# EasyEDA schematic SCH_Solární-měřič_2024-04-14.json
TITLE: Sheet_1; REV: 1.0; Date: 2024-04-11; Sheet: 1/1; Drawn By: TomTrom; Company: Your Company
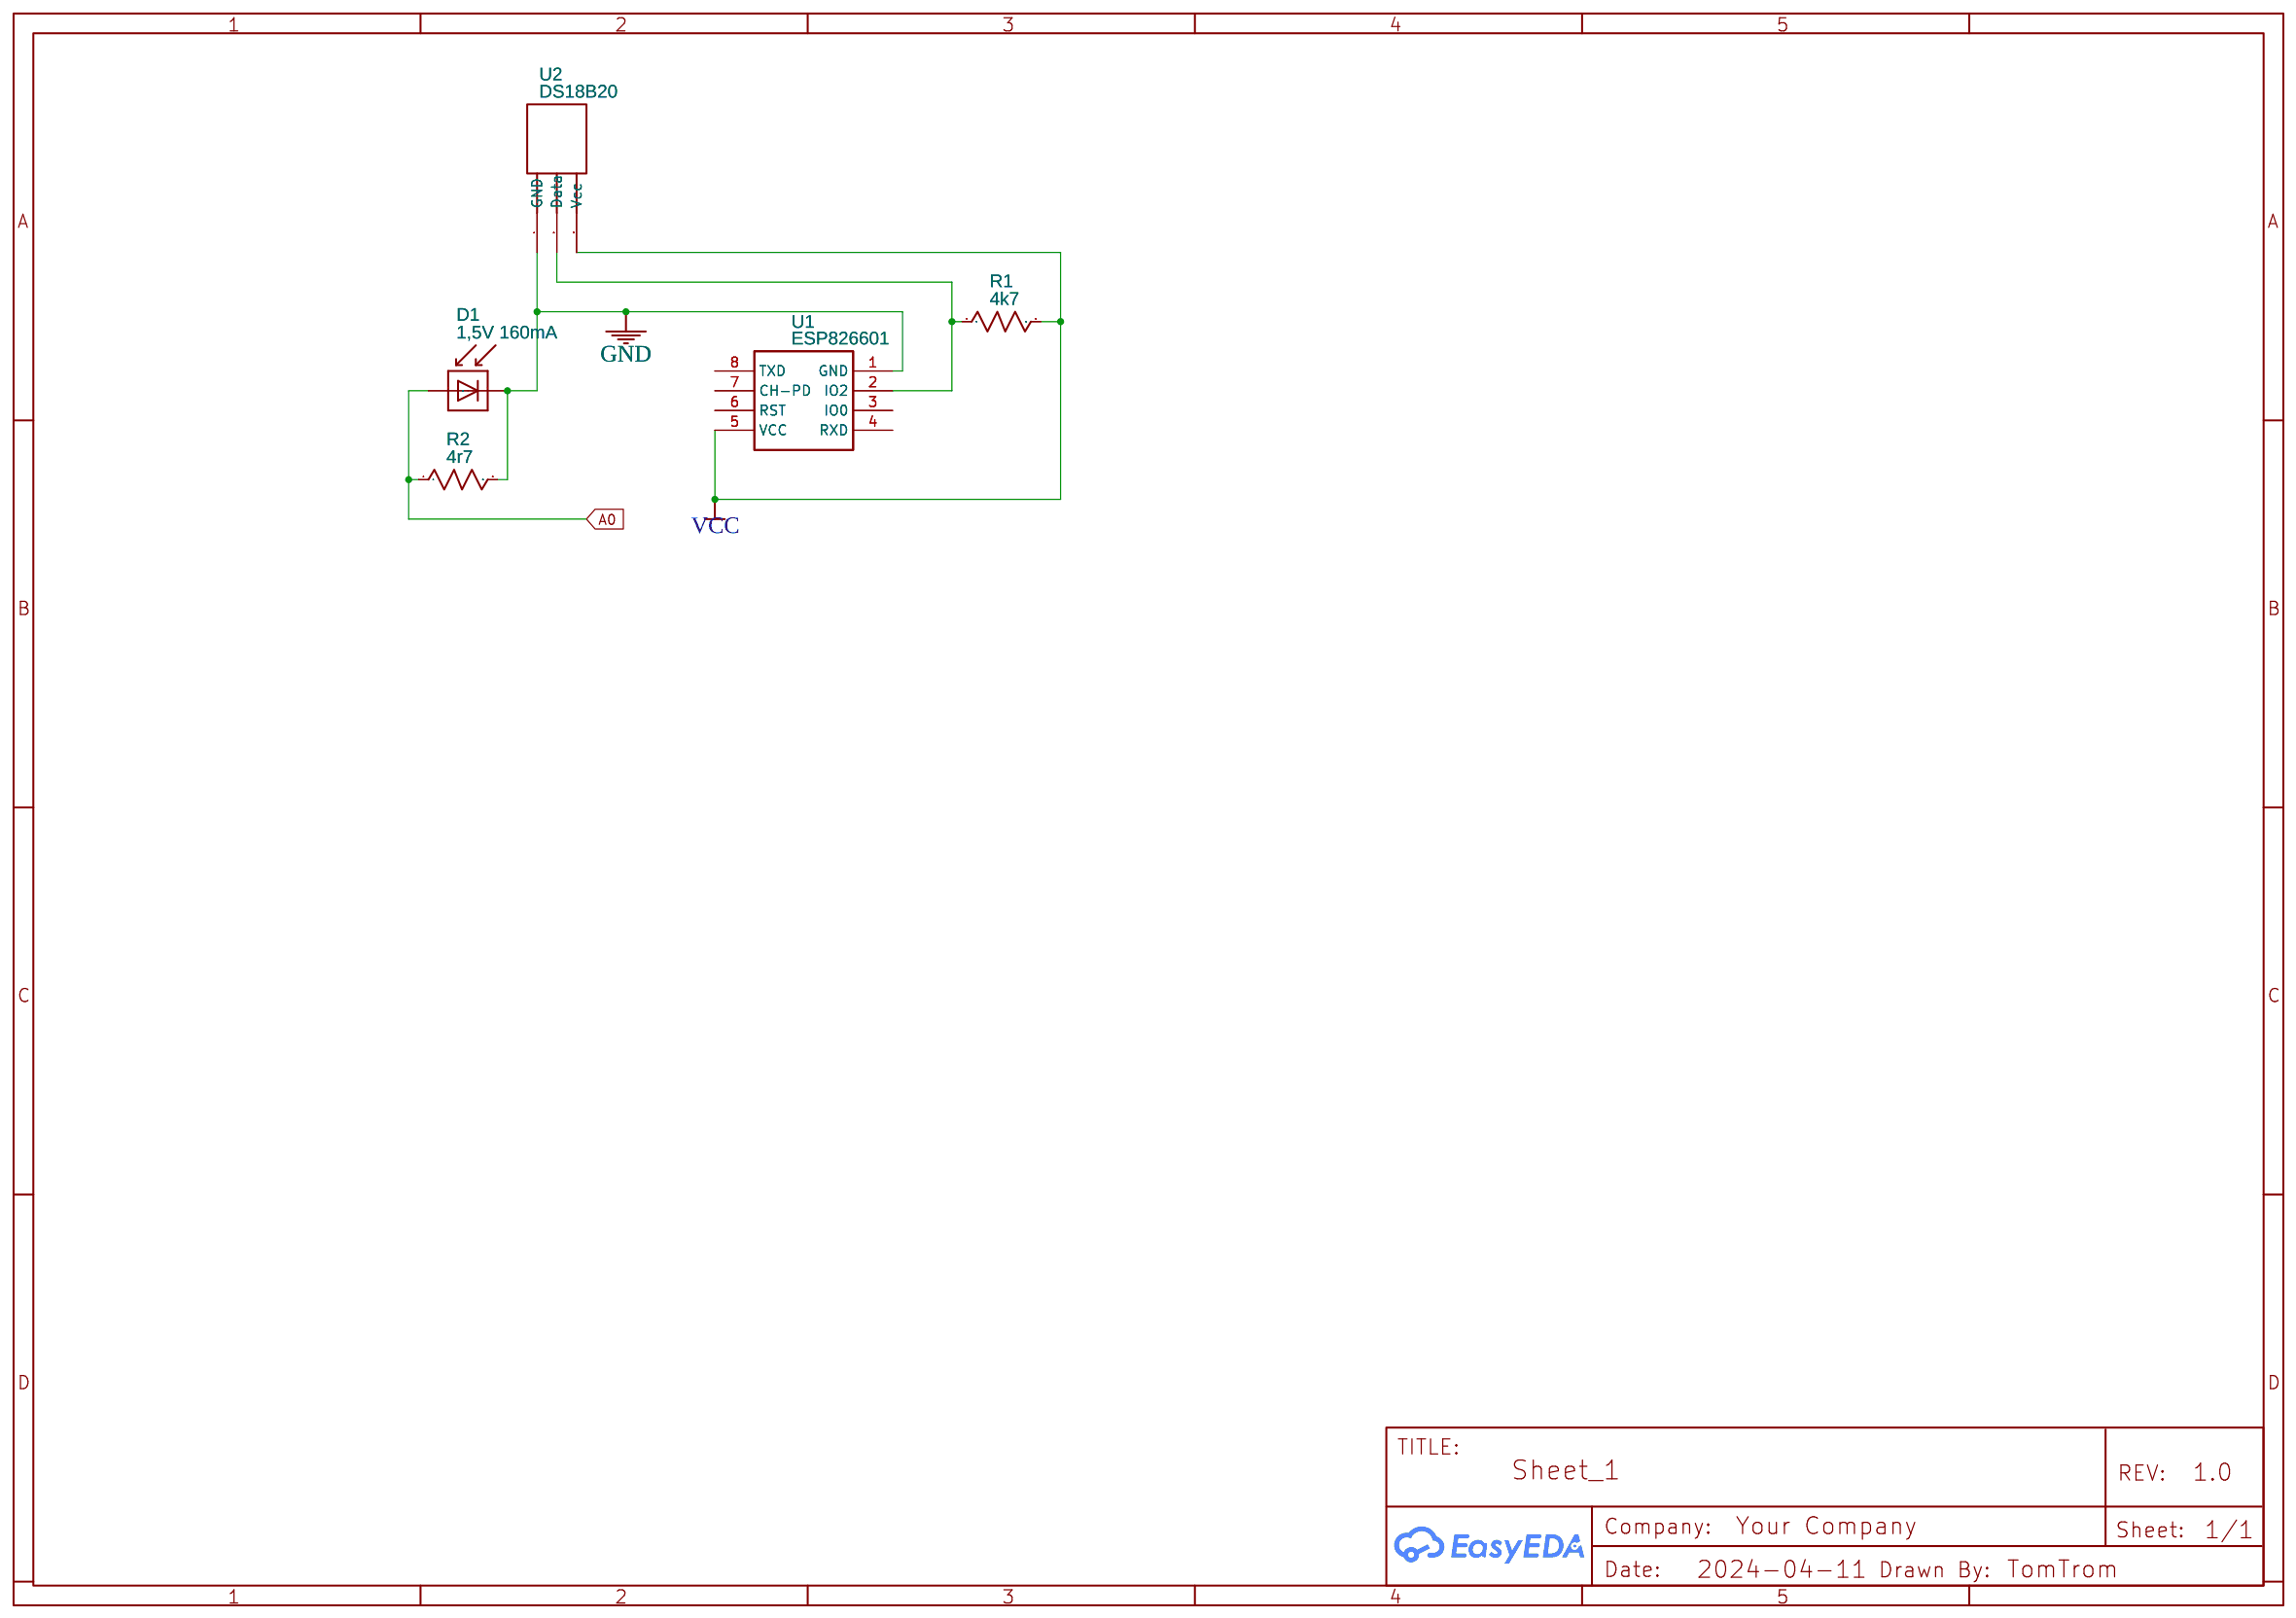
[diagram p0: schematic sheet]

## Parts
D1  1,5V 160mA  [SOLARBIT-14X1]
R1  4k7  [AXIAL-0.3]
R2  4r7  [AXIAL-0.3]
U1  ESP826601  [ESP8266-01]
U2  DS18B20  [DS18B20_DALLAS]

## Library data of the parts
D1 = ‎KXOB25-14X1F‎: Contributor: SparkFun
R1 R2 = Resistor_US: Resistance: 1k; Contributor: EasyEDA; Supplier: YUJING
U1 = ESP826601: catid: 20; Contributor: SSK; sim: true
U2 = DS18B20: Contributor: tornado2003x; sim: true

## Nets
GND: D1.-(C) R2.2 U1.1(GND) U2.1(GND)
VCC: R1.2 U1.5(VCC) U2.3(Vcc)
A0: D1.+(A) R2.1
Net-(R1-1): R1.1 U1.2(IO2) U2.2(Data)

Not connected (* = marked no-connect by the designer): U1 3(IO0) 4(RXD) 6(RST) 7(CH-PD) 8(TXD)
